# EAGLE schematic tester (EAGLE 6.4)
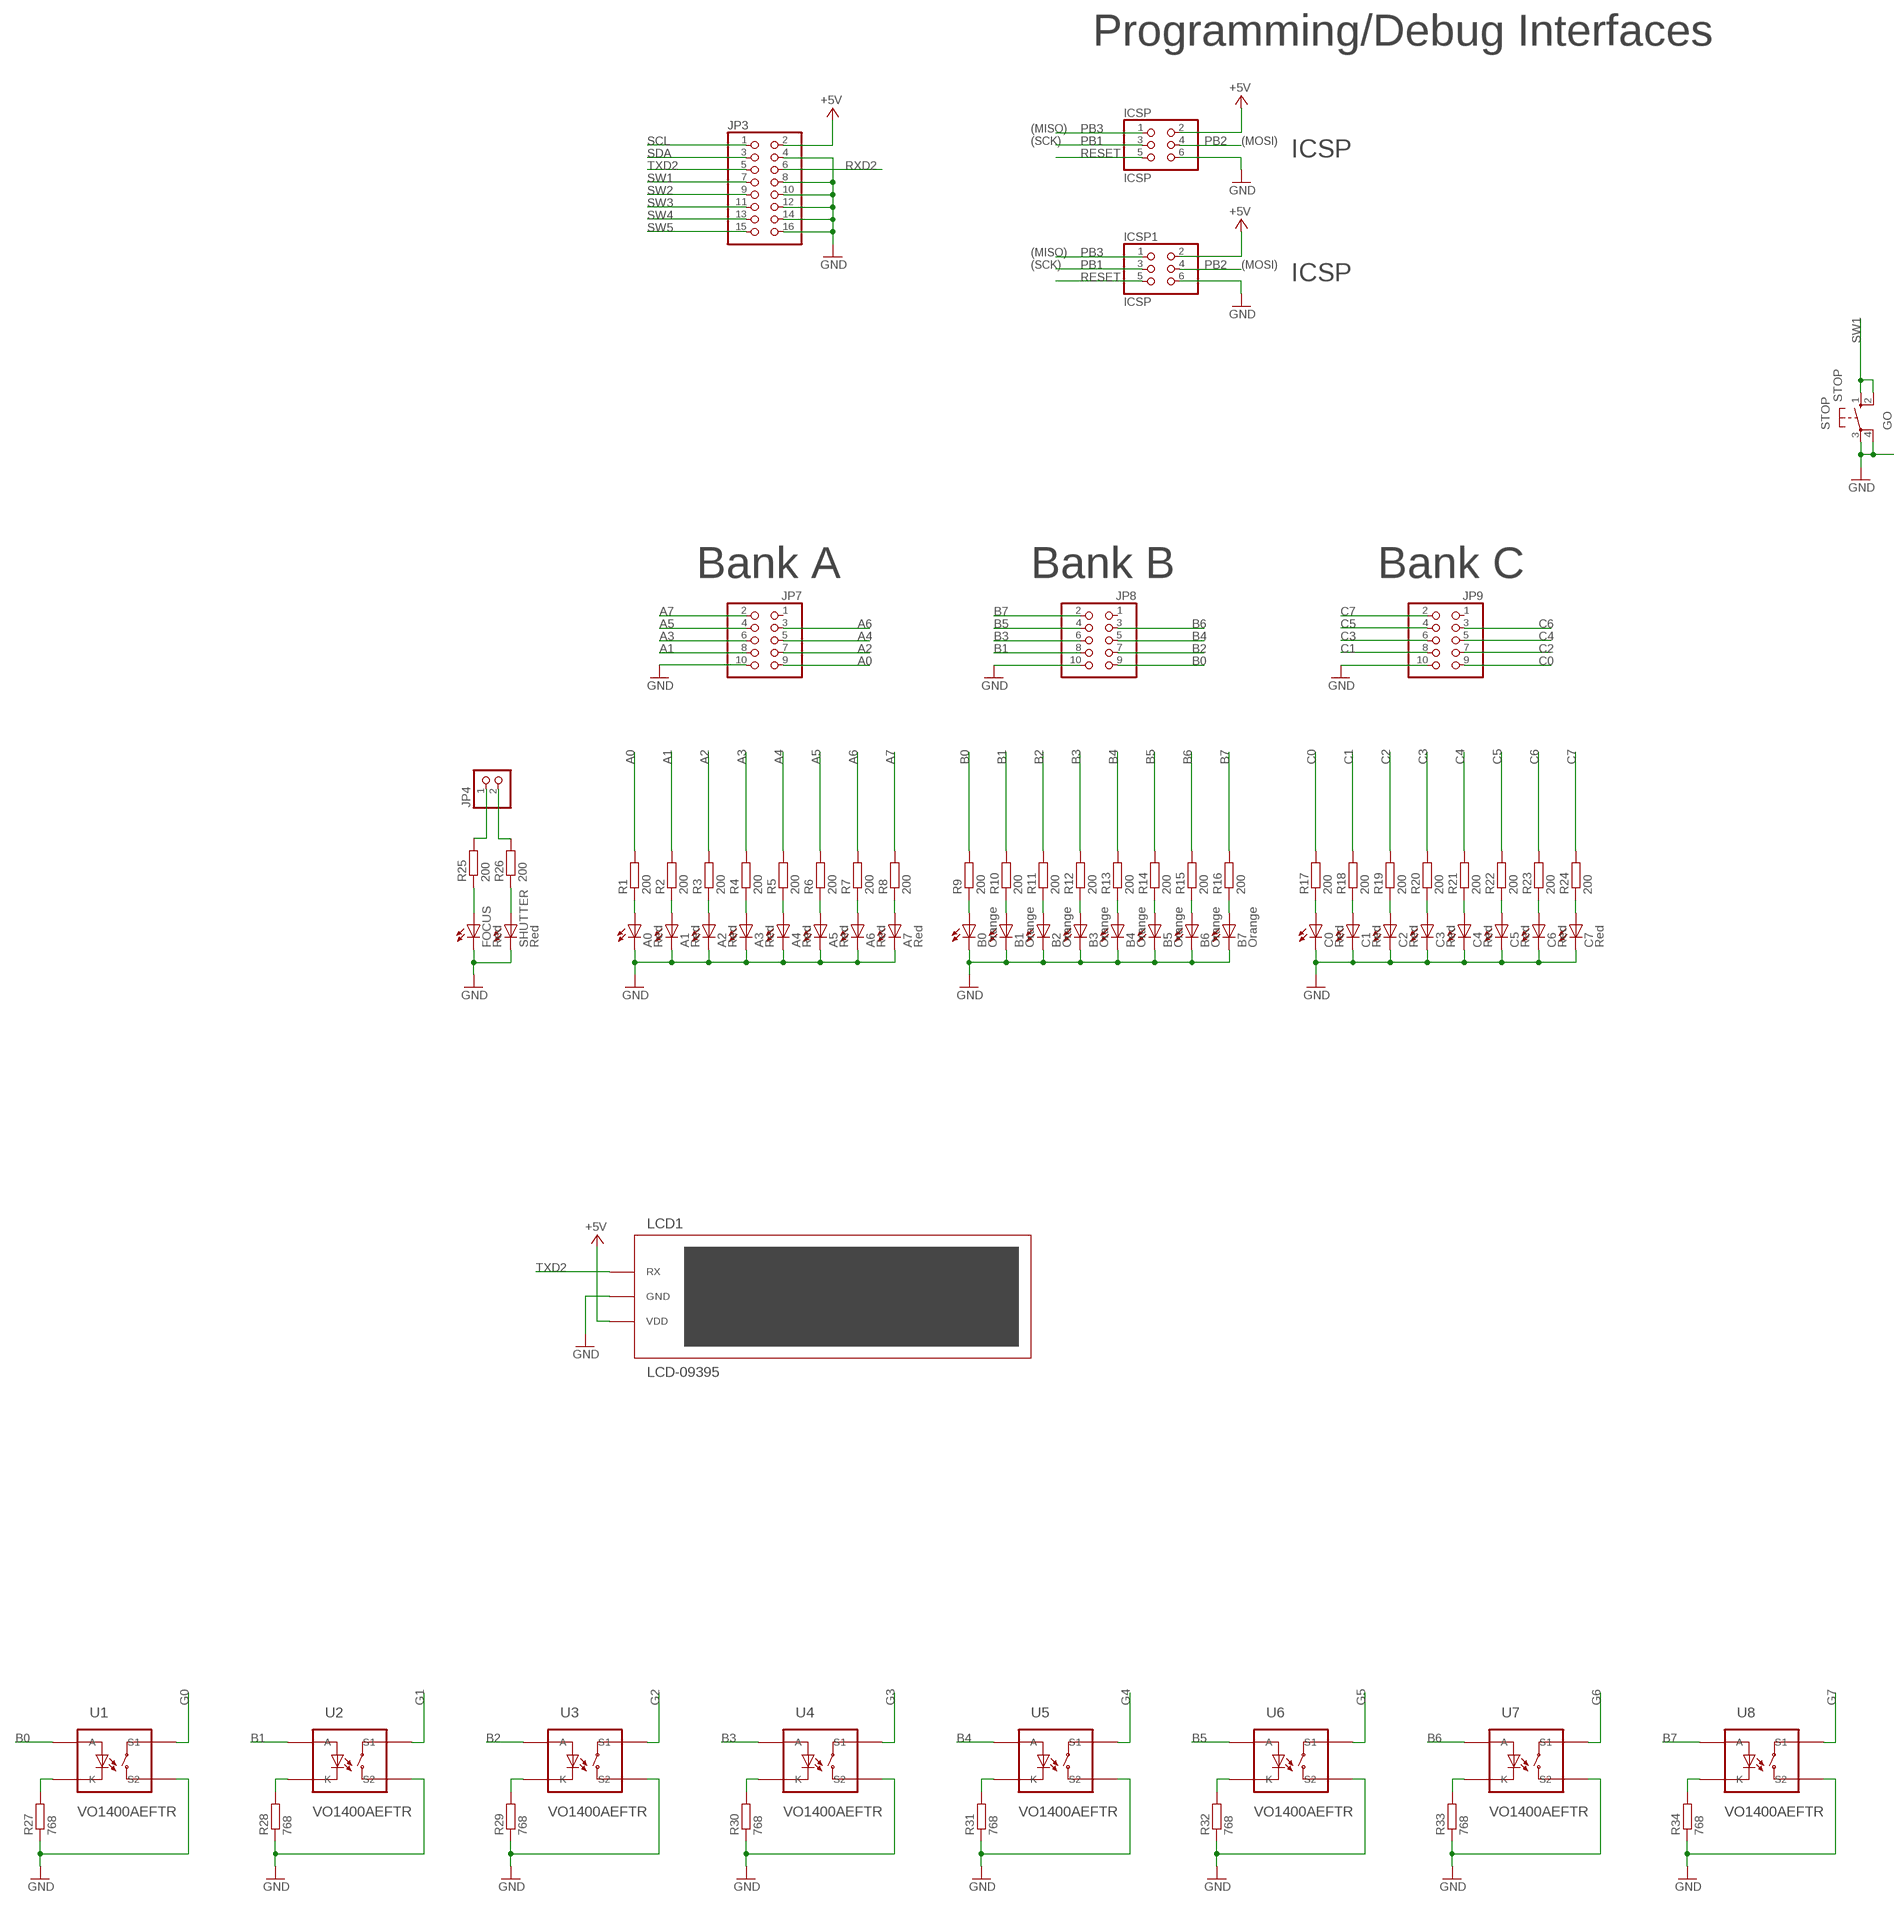
[diagram p0: schematic, sheet 1, part 1 of 2]
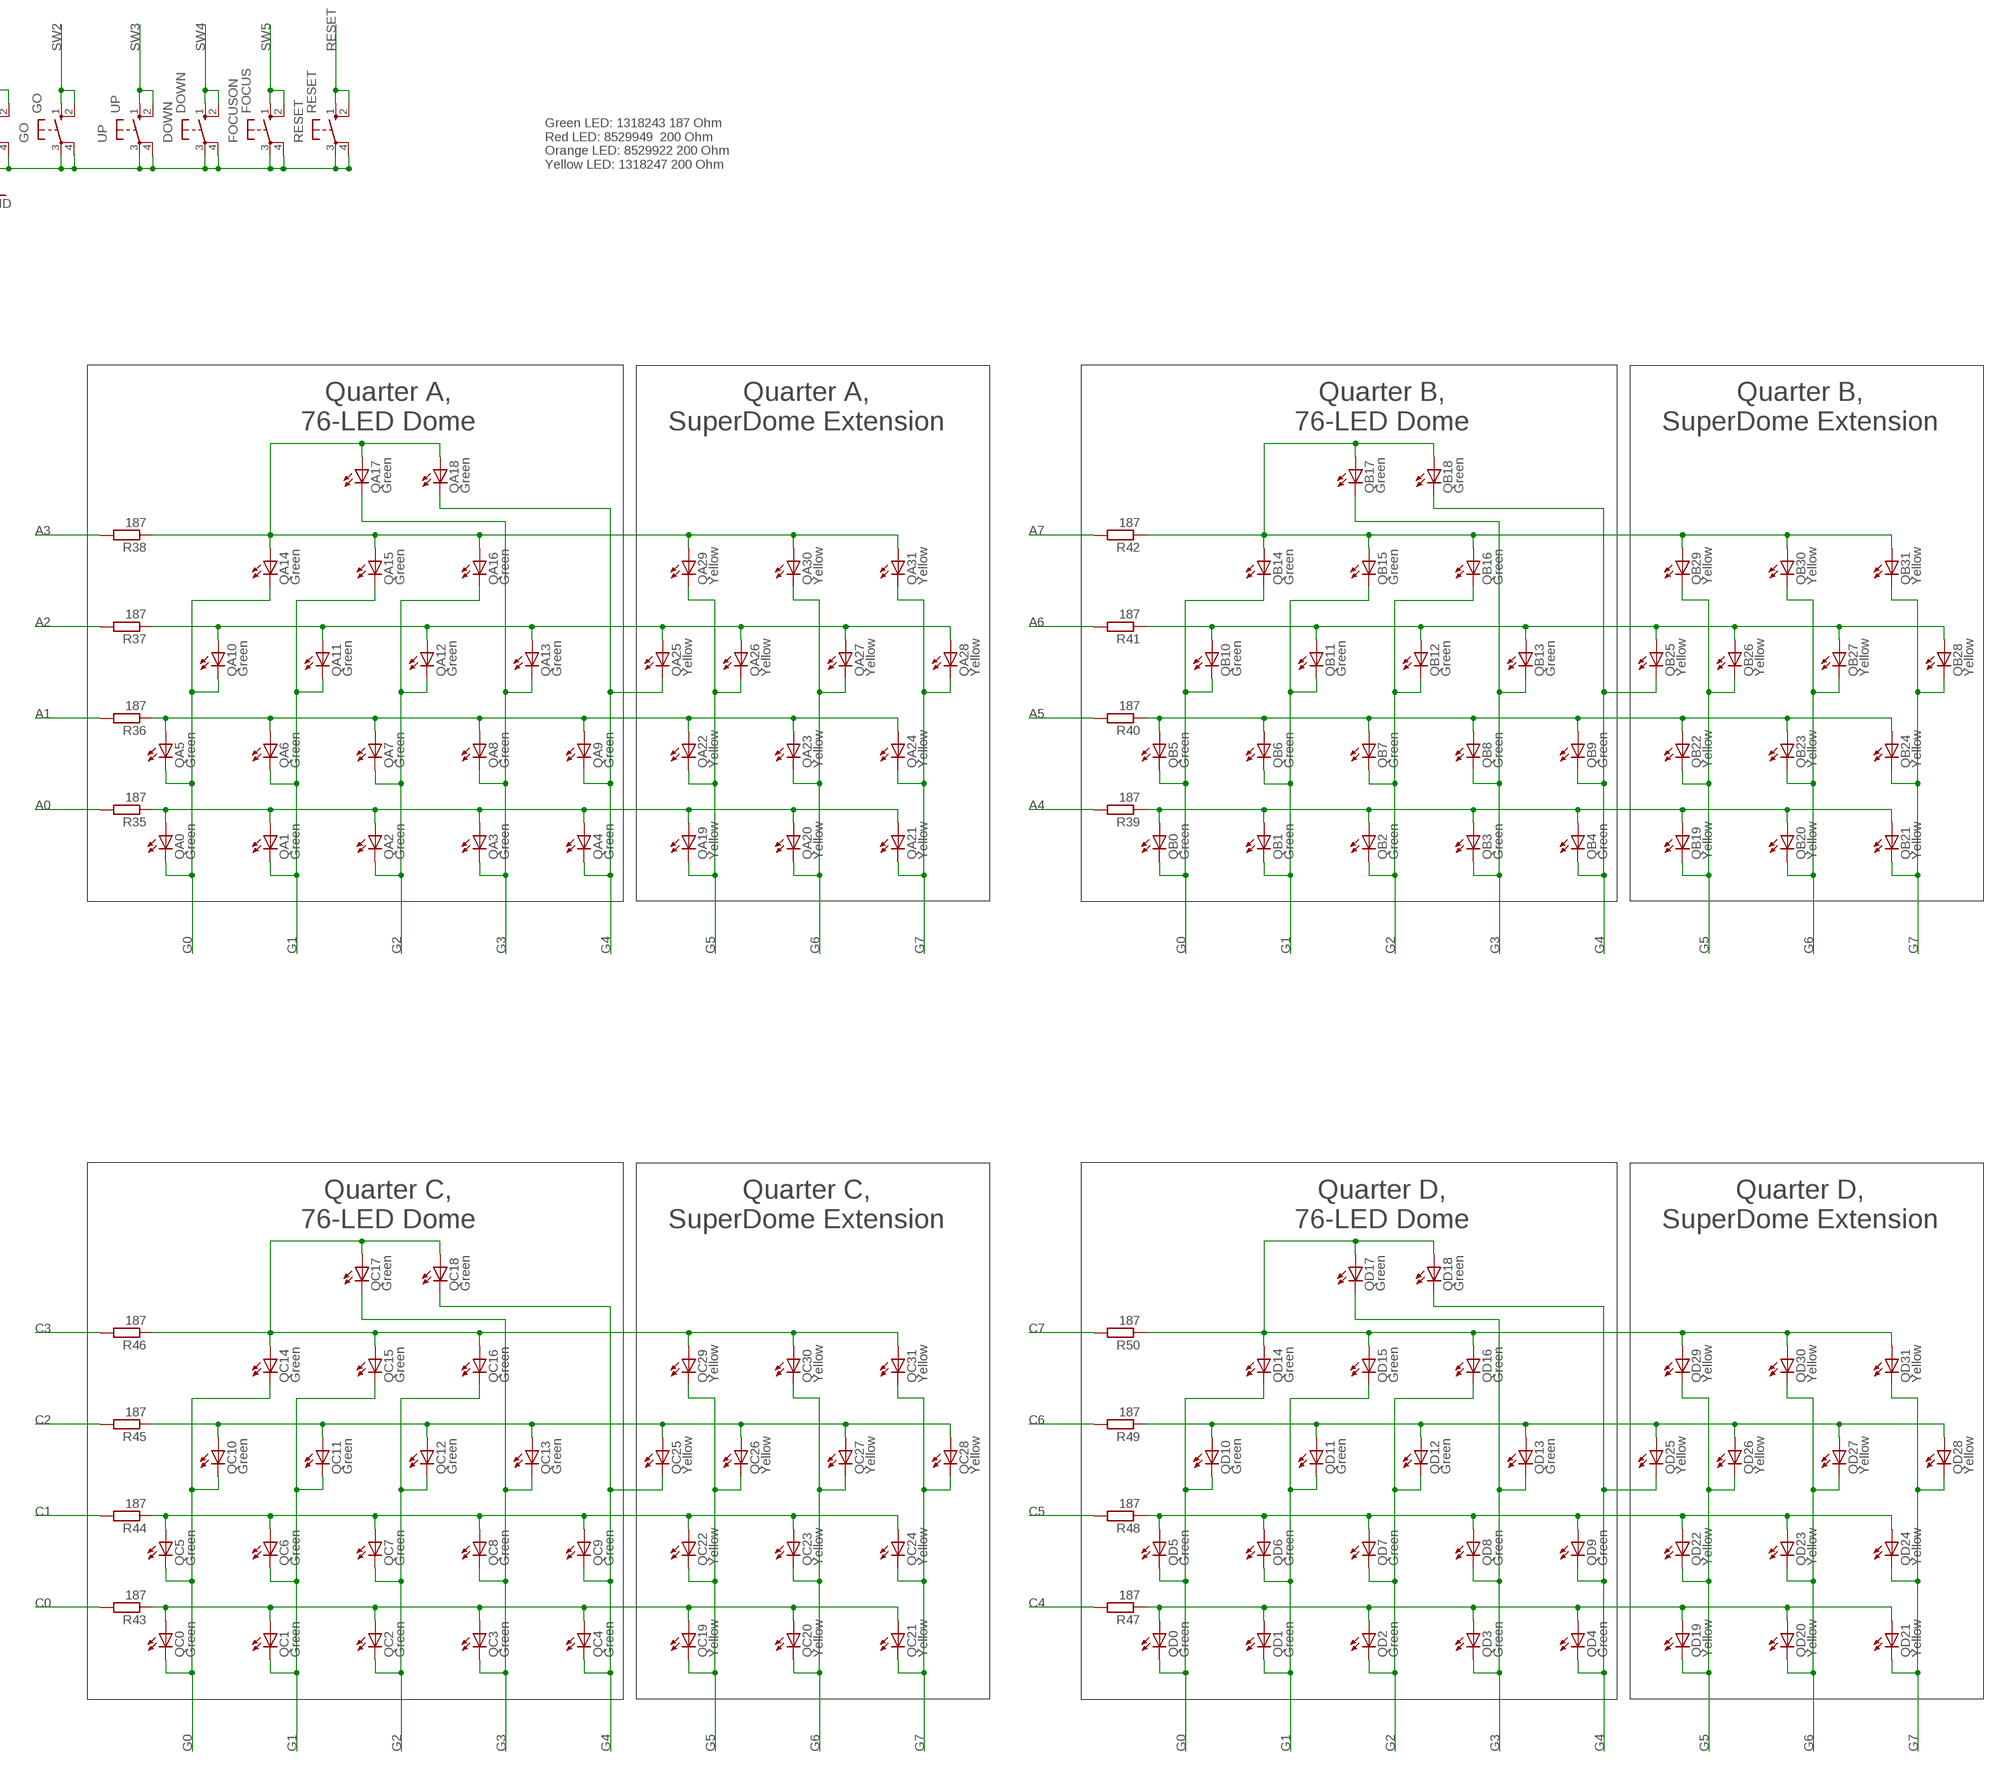
[diagram p1: schematic, sheet 1, part 2 of 2]

## Parts
A0  Red  LEDCHIP-LED0805  [CHIP-LED0805]
A1  Red  LEDCHIP-LED0805  [CHIP-LED0805]
A2  Red  LEDCHIP-LED0805  [CHIP-LED0805]
A3  Red  LEDCHIP-LED0805  [CHIP-LED0805]
A4  Red  LEDCHIP-LED0805  [CHIP-LED0805]
A5  Red  LEDCHIP-LED0805  [CHIP-LED0805]
A6  Red  LEDCHIP-LED0805  [CHIP-LED0805]
A7  Red  LEDCHIP-LED0805  [CHIP-LED0805]
B0  Orange  LEDCHIP-LED0805  [CHIP-LED0805]
B1  Orange  LEDCHIP-LED0805  [CHIP-LED0805]
B2  Orange  LEDCHIP-LED0805  [CHIP-LED0805]
B3  Orange  LEDCHIP-LED0805  [CHIP-LED0805]
B4  Orange  LEDCHIP-LED0805  [CHIP-LED0805]
B5  Orange  LEDCHIP-LED0805  [CHIP-LED0805]
B6  Orange  LEDCHIP-LED0805  [CHIP-LED0805]
B7  Orange  LEDCHIP-LED0805  [CHIP-LED0805]
C0  Red  LEDCHIP-LED0805  [CHIP-LED0805]
C1  Red  LEDCHIP-LED0805  [CHIP-LED0805]
C2  Red  LEDCHIP-LED0805  [CHIP-LED0805]
C3  Red  LEDCHIP-LED0805  [CHIP-LED0805]
C4  Red  LEDCHIP-LED0805  [CHIP-LED0805]
C5  Red  LEDCHIP-LED0805  [CHIP-LED0805]
C6  Red  LEDCHIP-LED0805  [CHIP-LED0805]
C7  Red  LEDCHIP-LED0805  [CHIP-LED0805]
DOWN  DOWN  10-XX  [B3F-10XX]
FOCUS  Red  LEDCHIP-LED0805  [CHIP-LED0805]
FOCUSON  FOCUS  10-XX  [B3F-10XX]
GO  GO  10-XX  [B3F-10XX]
ICSP  ICSP  PINHD-2X3  [2X03]
ICSP1  ICSP  PINHD-2X3  [2X03]
JP3  PINHD-2X8  [2X08]
JP4  PINHD-1X2  [1X02]
JP7  PINHD-2X5  [2X05]
JP8  PINHD-2X5  [2X05]
JP9  PINHD-2X5  [2X05]
LCD1  LCD-09395  [LCD-09395]
QA0  Green  LEDCHIP-LED0805  [CHIP-LED0805]
QA1  Green  LEDCHIP-LED0805  [CHIP-LED0805]
QA2  Green  LEDCHIP-LED0805  [CHIP-LED0805]
QA3  Green  LEDCHIP-LED0805  [CHIP-LED0805]
QA4  Green  LEDCHIP-LED0805  [CHIP-LED0805]
QA5  Green  LEDCHIP-LED0805  [CHIP-LED0805]
QA6  Green  LEDCHIP-LED0805  [CHIP-LED0805]
QA7  Green  LEDCHIP-LED0805  [CHIP-LED0805]
QA8  Green  LEDCHIP-LED0805  [CHIP-LED0805]
QA9  Green  LEDCHIP-LED0805  [CHIP-LED0805]
QA10  Green  LEDCHIP-LED0805  [CHIP-LED0805]
QA11  Green  LEDCHIP-LED0805  [CHIP-LED0805]
QA12  Green  LEDCHIP-LED0805  [CHIP-LED0805]
QA13  Green  LEDCHIP-LED0805  [CHIP-LED0805]
QA14  Green  LEDCHIP-LED0805  [CHIP-LED0805]
QA15  Green  LEDCHIP-LED0805  [CHIP-LED0805]
QA16  Green  LEDCHIP-LED0805  [CHIP-LED0805]
QA17  Green  LEDCHIP-LED0805  [CHIP-LED0805]
QA18  Green  LEDCHIP-LED0805  [CHIP-LED0805]
QA19  Yellow  LEDCHIP-LED0805  [CHIP-LED0805]
QA20  Yellow  LEDCHIP-LED0805  [CHIP-LED0805]
QA21  Yellow  LEDCHIP-LED0805  [CHIP-LED0805]
QA22  Yellow  LEDCHIP-LED0805  [CHIP-LED0805]
QA23  Yellow  LEDCHIP-LED0805  [CHIP-LED0805]
QA24  Yellow  LEDCHIP-LED0805  [CHIP-LED0805]
QA25  Yellow  LEDCHIP-LED0805  [CHIP-LED0805]
QA26  Yellow  LEDCHIP-LED0805  [CHIP-LED0805]
QA27  Yellow  LEDCHIP-LED0805  [CHIP-LED0805]
QA28  Yellow  LEDCHIP-LED0805  [CHIP-LED0805]
QA29  Yellow  LEDCHIP-LED0805  [CHIP-LED0805]
QA30  Yellow  LEDCHIP-LED0805  [CHIP-LED0805]
QA31  Yellow  LEDCHIP-LED0805  [CHIP-LED0805]
QB0  Green  LEDCHIP-LED0805  [CHIP-LED0805]
QB1  Green  LEDCHIP-LED0805  [CHIP-LED0805]
QB2  Green  LEDCHIP-LED0805  [CHIP-LED0805]
QB3  Green  LEDCHIP-LED0805  [CHIP-LED0805]
QB4  Green  LEDCHIP-LED0805  [CHIP-LED0805]
QB5  Green  LEDCHIP-LED0805  [CHIP-LED0805]
QB6  Green  LEDCHIP-LED0805  [CHIP-LED0805]
QB7  Green  LEDCHIP-LED0805  [CHIP-LED0805]
QB8  Green  LEDCHIP-LED0805  [CHIP-LED0805]
QB9  Green  LEDCHIP-LED0805  [CHIP-LED0805]
QB10  Green  LEDCHIP-LED0805  [CHIP-LED0805]
QB11  Green  LEDCHIP-LED0805  [CHIP-LED0805]
QB12  Green  LEDCHIP-LED0805  [CHIP-LED0805]
QB13  Green  LEDCHIP-LED0805  [CHIP-LED0805]
QB14  Green  LEDCHIP-LED0805  [CHIP-LED0805]
QB15  Green  LEDCHIP-LED0805  [CHIP-LED0805]
QB16  Green  LEDCHIP-LED0805  [CHIP-LED0805]
QB17  Green  LEDCHIP-LED0805  [CHIP-LED0805]
QB18  Green  LEDCHIP-LED0805  [CHIP-LED0805]
QB19  Yellow  LEDCHIP-LED0805  [CHIP-LED0805]
QB20  Yellow  LEDCHIP-LED0805  [CHIP-LED0805]
QB21  Yellow  LEDCHIP-LED0805  [CHIP-LED0805]
QB22  Yellow  LEDCHIP-LED0805  [CHIP-LED0805]
QB23  Yellow  LEDCHIP-LED0805  [CHIP-LED0805]
QB24  Yellow  LEDCHIP-LED0805  [CHIP-LED0805]
QB25  Yellow  LEDCHIP-LED0805  [CHIP-LED0805]
QB26  Yellow  LEDCHIP-LED0805  [CHIP-LED0805]
QB27  Yellow  LEDCHIP-LED0805  [CHIP-LED0805]
QB28  Yellow  LEDCHIP-LED0805  [CHIP-LED0805]
QB29  Yellow  LEDCHIP-LED0805  [CHIP-LED0805]
QB30  Yellow  LEDCHIP-LED0805  [CHIP-LED0805]
QB31  Yellow  LEDCHIP-LED0805  [CHIP-LED0805]
QC0  Green  LEDCHIP-LED0805  [CHIP-LED0805]
QC1  Green  LEDCHIP-LED0805  [CHIP-LED0805]
QC2  Green  LEDCHIP-LED0805  [CHIP-LED0805]
QC3  Green  LEDCHIP-LED0805  [CHIP-LED0805]
QC4  Green  LEDCHIP-LED0805  [CHIP-LED0805]
QC5  Green  LEDCHIP-LED0805  [CHIP-LED0805]
QC6  Green  LEDCHIP-LED0805  [CHIP-LED0805]
QC7  Green  LEDCHIP-LED0805  [CHIP-LED0805]
QC8  Green  LEDCHIP-LED0805  [CHIP-LED0805]
QC9  Green  LEDCHIP-LED0805  [CHIP-LED0805]
QC10  Green  LEDCHIP-LED0805  [CHIP-LED0805]
QC11  Green  LEDCHIP-LED0805  [CHIP-LED0805]
QC12  Green  LEDCHIP-LED0805  [CHIP-LED0805]
QC13  Green  LEDCHIP-LED0805  [CHIP-LED0805]
QC14  Green  LEDCHIP-LED0805  [CHIP-LED0805]
QC15  Green  LEDCHIP-LED0805  [CHIP-LED0805]
QC16  Green  LEDCHIP-LED0805  [CHIP-LED0805]
QC17  Green  LEDCHIP-LED0805  [CHIP-LED0805]
QC18  Green  LEDCHIP-LED0805  [CHIP-LED0805]
QC19  Yellow  LEDCHIP-LED0805  [CHIP-LED0805]
QC20  Yellow  LEDCHIP-LED0805  [CHIP-LED0805]
QC21  Yellow  LEDCHIP-LED0805  [CHIP-LED0805]
QC22  Yellow  LEDCHIP-LED0805  [CHIP-LED0805]
QC23  Yellow  LEDCHIP-LED0805  [CHIP-LED0805]
QC24  Yellow  LEDCHIP-LED0805  [CHIP-LED0805]
QC25  Yellow  LEDCHIP-LED0805  [CHIP-LED0805]
QC26  Yellow  LEDCHIP-LED0805  [CHIP-LED0805]
QC27  Yellow  LEDCHIP-LED0805  [CHIP-LED0805]
QC28  Yellow  LEDCHIP-LED0805  [CHIP-LED0805]
QC29  Yellow  LEDCHIP-LED0805  [CHIP-LED0805]
QC30  Yellow  LEDCHIP-LED0805  [CHIP-LED0805]
QC31  Yellow  LEDCHIP-LED0805  [CHIP-LED0805]
QD0  Green  LEDCHIP-LED0805  [CHIP-LED0805]
QD1  Green  LEDCHIP-LED0805  [CHIP-LED0805]
QD2  Green  LEDCHIP-LED0805  [CHIP-LED0805]
QD3  Green  LEDCHIP-LED0805  [CHIP-LED0805]
QD4  Green  LEDCHIP-LED0805  [CHIP-LED0805]
QD5  Green  LEDCHIP-LED0805  [CHIP-LED0805]
QD6  Green  LEDCHIP-LED0805  [CHIP-LED0805]
QD7  Green  LEDCHIP-LED0805  [CHIP-LED0805]
QD8  Green  LEDCHIP-LED0805  [CHIP-LED0805]
QD9  Green  LEDCHIP-LED0805  [CHIP-LED0805]
QD10  Green  LEDCHIP-LED0805  [CHIP-LED0805]
QD11  Green  LEDCHIP-LED0805  [CHIP-LED0805]
QD12  Green  LEDCHIP-LED0805  [CHIP-LED0805]
QD13  Green  LEDCHIP-LED0805  [CHIP-LED0805]
QD14  Green  LEDCHIP-LED0805  [CHIP-LED0805]
QD15  Green  LEDCHIP-LED0805  [CHIP-LED0805]
QD16  Green  LEDCHIP-LED0805  [CHIP-LED0805]
QD17  Green  LEDCHIP-LED0805  [CHIP-LED0805]
QD18  Green  LEDCHIP-LED0805  [CHIP-LED0805]
QD19  Yellow  LEDCHIP-LED0805  [CHIP-LED0805]
QD20  Yellow  LEDCHIP-LED0805  [CHIP-LED0805]
QD21  Yellow  LEDCHIP-LED0805  [CHIP-LED0805]
QD22  Yellow  LEDCHIP-LED0805  [CHIP-LED0805]
QD23  Yellow  LEDCHIP-LED0805  [CHIP-LED0805]
QD24  Yellow  LEDCHIP-LED0805  [CHIP-LED0805]
QD25  Yellow  LEDCHIP-LED0805  [CHIP-LED0805]
QD26  Yellow  LEDCHIP-LED0805  [CHIP-LED0805]
QD27  Yellow  LEDCHIP-LED0805  [CHIP-LED0805]
QD28  Yellow  LEDCHIP-LED0805  [CHIP-LED0805]
QD29  Yellow  LEDCHIP-LED0805  [CHIP-LED0805]
QD30  Yellow  LEDCHIP-LED0805  [CHIP-LED0805]
QD31  Yellow  LEDCHIP-LED0805  [CHIP-LED0805]
R1  200  R-EU_R0805  [R0805]
R2  200  R-EU_R0805  [R0805]
R3  200  R-EU_R0805  [R0805]
R4  200  R-EU_R0805  [R0805]
R5  200  R-EU_R0805  [R0805]
R6  200  R-EU_R0805  [R0805]
R7  200  R-EU_R0805  [R0805]
R8  200  R-EU_R0805  [R0805]
R9  200  R-EU_R0805  [R0805]
R10  200  R-EU_R0805  [R0805]
R11  200  R-EU_R0805  [R0805]
R12  200  R-EU_R0805  [R0805]
R13  200  R-EU_R0805  [R0805]
R14  200  R-EU_R0805  [R0805]
R15  200  R-EU_R0805  [R0805]
R16  200  R-EU_R0805  [R0805]
R17  200  R-EU_R0805  [R0805]
R18  200  R-EU_R0805  [R0805]
R19  200  R-EU_R0805  [R0805]
R20  200  R-EU_R0805  [R0805]
R21  200  R-EU_R0805  [R0805]
R22  200  R-EU_R0805  [R0805]
R23  200  R-EU_R0805  [R0805]
R24  200  R-EU_R0805  [R0805]
R25  200  R-EU_R0805  [R0805]
R26  200  R-EU_R0805  [R0805]
R27  768  R-EU_R0805  [R0805]
R28  768  R-EU_R0805  [R0805]
R29  768  R-EU_R0805  [R0805]
R30  768  R-EU_R0805  [R0805]
R31  768  R-EU_R0805  [R0805]
R32  768  R-EU_R0805  [R0805]
R33  768  R-EU_R0805  [R0805]
R34  768  R-EU_R0805  [R0805]
R35  187  R-EU_R0805  [R0805]
R36  187  R-EU_R0805  [R0805]
R37  187  R-EU_R0805  [R0805]
R38  187  R-EU_R0805  [R0805]
R39  187  R-EU_R0805  [R0805]
R40  187  R-EU_R0805  [R0805]
R41  187  R-EU_R0805  [R0805]
R42  187  R-EU_R0805  [R0805]
R43  187  R-EU_R0805  [R0805]
R44  187  R-EU_R0805  [R0805]
R45  187  R-EU_R0805  [R0805]
R46  187  R-EU_R0805  [R0805]
R47  187  R-EU_R0805  [R0805]
R48  187  R-EU_R0805  [R0805]
R49  187  R-EU_R0805  [R0805]
R50  187  R-EU_R0805  [R0805]
RESET  RESET  10-XX  [B3F-10XX]
SHUTTER  Red  LEDCHIP-LED0805  [CHIP-LED0805]
STOP  STOP  10-XX  [B3F-10XX]
U1  VO1400AEFTR  [SOP4]
U2  VO1400AEFTR  [SOP4]
U3  VO1400AEFTR  [SOP4]
U4  VO1400AEFTR  [SOP4]
U5  VO1400AEFTR  [SOP4]
U6  VO1400AEFTR  [SOP4]
U7  VO1400AEFTR  [SOP4]
U8  VO1400AEFTR  [SOP4]
UP  UP  10-XX  [B3F-10XX]

## Nets
+5V [usbvcc]: ICSP1.2 ICSP.2 JP3.2 LCD1.P$3(VDD)
A0: JP7.9 R1.2 R35.2
A1: JP7.8 R2.2 R36.2
A2: JP7.7 R3.2 R37.2
A3: JP7.6 R4.2 R38.2
A4: JP7.5 R5.2 R39.2
A5: JP7.4 R6.2 R40.2
A6: JP7.3 R7.2 R41.2
A7: JP7.2 R8.2 R42.2
B0: JP8.9 R9.2 U1.P$1(A)
B1: JP8.8 R10.2 U2.P$1(A)
B2: JP8.7 R11.2 U3.P$1(A)
B3: JP8.6 R12.2 U4.P$1(A)
B4: JP8.5 R13.2 U5.P$1(A)
B5: JP8.4 R14.2 U6.P$1(A)
B6: JP8.3 R15.2 U7.P$1(A)
B7: JP8.2 R16.2 U8.P$1(A)
C0: JP9.9 R17.2 R43.2
C1: JP9.8 R18.2 R44.2
C2: JP9.7 R19.2 R45.2
C3: JP9.6 R20.2 R46.2
C4: JP9.5 R21.2 R47.2
C5: JP9.4 R22.2 R48.2
C6: JP9.3 R23.2 R49.2
C7: JP9.2 R24.2 R50.2
FOCUS: JP4.1 R25.2
G0: QA0.C QA5.C QA10.C QA14.C QB0.C QB5.C QB10.C QB14.C QC0.C QC5.C QC10.C QC14.C QD0.C QD5.C QD10.C QD14.C U1.P$4(S1)
G1: QA1.C QA6.C QA11.C QA15.C QB1.C QB6.C QB11.C QB15.C QC1.C QC6.C QC11.C QC15.C QD1.C QD6.C QD11.C QD15.C U2.P$4(S1)
G2: QA2.C QA7.C QA12.C QA16.C QB2.C QB7.C QB12.C QB16.C QC2.C QC7.C QC12.C QC16.C QD2.C QD7.C QD12.C QD16.C U3.P$4(S1)
G3: QA3.C QA8.C QA13.C QA17.C QB3.C QB8.C QB13.C QB17.C QC3.C QC8.C QC13.C QC17.C QD3.C QD8.C QD13.C QD17.C U4.P$4(S1)
G4: QA4.C QA9.C QA18.C QA25.C QB4.C QB9.C QB18.C QB25.C QC4.C QC9.C QC18.C QC25.C QD4.C QD9.C QD18.C QD25.C U5.P$4(S1)
G5: QA19.C QA22.C QA26.C QA29.C QB19.C QB22.C QB26.C QB29.C QC19.C QC22.C QC26.C QC29.C QD19.C QD22.C QD26.C QD29.C U6.P$4(S1)
G6: QA20.C QA23.C QA27.C QA30.C QB20.C QB23.C QB27.C QB30.C QC20.C QC23.C QC27.C QC30.C QD20.C QD23.C QD27.C QD30.C U7.P$4(S1)
G7: QA21.C QA24.C QA28.C QA31.C QB21.C QB24.C QB28.C QB31.C QC21.C QC24.C QC28.C QC31.C QD21.C QD24.C QD28.C QD31.C U8.P$4(S1)
GND [gnd]: A0.C A1.C A2.C A3.C A4.C A5.C A6.C A7.C B0.C B1.C B2.C B3.C B4.C B5.C B6.C B7.C C0.C C1.C C2.C C3.C C4.C C5.C C6.C C7.C DOWN.3(P) DOWN.4(P1) FOCUS.C FOCUSON.3(P) FOCUSON.4(P1) GO.3(P) GO.4(P1) ICSP1.6 ICSP.6 JP3.4 JP3.8 JP3.10 JP3.12 JP3.14 JP3.16 JP7.10 JP8.10 JP9.10 LCD1.P$2(GND) R27.1 R28.1 R29.1 R30.1 R31.1 R32.1 R33.1 R34.1 RESET.3(P) RESET.4(P1) SHUTTER.C STOP.3(P) STOP.4(P1) U1.P$3(S2) U2.P$3(S2) U3.P$3(S2) U4.P$3(S2) U5.P$3(S2) U6.P$3(S2) U7.P$3(S2) U8.P$3(S2) UP.3(P) UP.4(P1)
N$1: A0.A R1.1
N$2: A1.A R2.1
N$3: A2.A R3.1
N$4: A3.A R4.1
N$5: A4.A R5.1
N$8: A5.A R6.1
N$9: A6.A R7.1
N$10: A7.A R8.1
N$11: FOCUS.A R25.1
N$12: B0.A R9.1
N$13: B1.A R10.1
N$14: B2.A R11.1
N$15: B3.A R12.1
N$16: B4.A R13.1
N$17: B5.A R14.1
N$18: B6.A R15.1
N$19: B7.A R16.1
N$20: C0.A R17.1
N$21: C1.A R18.1
N$22: C2.A R19.1
N$23: C3.A R20.1
N$24: C4.A R21.1
N$25: C5.A R22.1
N$26: C6.A R23.1
N$27: C7.A R24.1
N$28: R26.1 SHUTTER.A
N$31: R27.2 U1.P$2(K)
N$38: R28.2 U2.P$2(K)
N$42: QA0.A QA1.A QA2.A QA3.A QA4.A QA19.A QA20.A QA21.A R35.1
N$43: QA5.A QA6.A QA7.A QA8.A QA9.A QA22.A QA23.A QA24.A R36.1
N$44: QA10.A QA11.A QA12.A QA13.A QA25.A QA26.A QA27.A QA28.A R37.1
N$45: QA14.A QA15.A QA16.A QA17.A QA18.A QA29.A QA30.A QA31.A R38.1
N$46: R29.2 U3.P$2(K)
N$55: QB0.A QB1.A QB2.A QB3.A QB4.A QB19.A QB20.A QB21.A R39.1
N$56: QB5.A QB6.A QB7.A QB8.A QB9.A QB22.A QB23.A QB24.A R40.1
N$57: QB10.A QB11.A QB12.A QB13.A QB25.A QB26.A QB27.A QB28.A R41.1
N$58: QB14.A QB15.A QB16.A QB17.A QB18.A QB29.A QB30.A QB31.A R42.1
N$67: QC0.A QC1.A QC2.A QC3.A QC4.A QC19.A QC20.A QC21.A R43.1
N$68: QC5.A QC6.A QC7.A QC8.A QC9.A QC22.A QC23.A QC24.A R44.1
N$69: QC10.A QC11.A QC12.A QC13.A QC25.A QC26.A QC27.A QC28.A R45.1
N$70: QC14.A QC15.A QC16.A QC17.A QC18.A QC29.A QC30.A QC31.A R46.1
N$79: QD0.A QD1.A QD2.A QD3.A QD4.A QD19.A QD20.A QD21.A R47.1
N$80: QD5.A QD6.A QD7.A QD8.A QD9.A QD22.A QD23.A QD24.A R48.1
N$81: QD10.A QD11.A QD12.A QD13.A QD25.A QD26.A QD27.A QD28.A R49.1
N$82: QD14.A QD15.A QD16.A QD17.A QD18.A QD29.A QD30.A QD31.A R50.1
N$83: R30.2 U4.P$2(K)
N$84: R31.2 U5.P$2(K)
N$85: R32.2 U6.P$2(K)
N$86: R33.2 U7.P$2(K)
N$87: R34.2 U8.P$2(K)
PB1: ICSP1.3 ICSP.3
PB2: ICSP1.4 ICSP.4
PB3: ICSP1.1 ICSP.1
RESET: ICSP1.5 ICSP.5 RESET.1(S) RESET.2(S1)
RXD2: JP3.6
SCL: JP3.1
SDA: JP3.3
SHUTTER: JP4.2 R26.2
SW1: JP3.7 STOP.1(S) STOP.2(S1)
SW2: GO.1(S) GO.2(S1) JP3.9
SW3: JP3.11 UP.1(S) UP.2(S1)
SW4: DOWN.1(S) DOWN.2(S1) JP3.13
SW5: FOCUSON.1(S) FOCUSON.2(S1) JP3.15
TXD2: JP3.5 LCD1.P$1(RX)
Unconnected: JP7.1 JP8.1 JP9.1

## Notes on the sheet
- Programming/Debug Interfaces
- (MISO)
- (SCK) | (MOSI)
- ICSP
- (MISO)
- (SCK) | (MOSI)
- ICSP
- Green LED:	1318243	187 Ohm
  Red LED:	8529949 	200 Ohm
  Orange LED:	8529922	200 Ohm
  Yellow LED:	1318247	200 Ohm
- Bank A | Bank B | Bank C
- Quarter A,
  76-LED Dome
- Quarter A,
  SuperDome Extension
- Quarter B,
  76-LED Dome
- Quarter B,
  SuperDome Extension
- Quarter C,
  76-LED Dome
- Quarter C,
  SuperDome Extension
- Quarter D,
  76-LED Dome
- Quarter D,
  SuperDome Extension

## Library data of the parts
A0 A1-A7 B0 B1-B7 C0 C1-C7 FOCUS QA0 QA1-QA31 QB0 QB1-QB31 QC0 QC1-QC31 QD0 QD1-QD31 SHUTTER = led:LED: LED OSRAM: - CHIPLED LG R971, LG N971, LY N971, LG Q971, LY Q971, LO R971, LY R971 LH N974, LH R974 LS Q976, LO Q976, LY Q976 LO Q996 - Hyper CHIPLED LW Q18S LB Q993, LB Q99A, LB R99A - SideLED LS A670, LO A670, LY A670, LG A670, LP A670 LB A673, LV A673, LT A673, LW A673 LH A674 LY A675 LS A676, LA A676, LO A676, LY A676, LW A676 LS A679, LY A679, LG A679 - Hyper Micro SIDELED® LS Y876, LA Y876, LO Y876, LY Y876 LT Y87S - SmartLED LW L88C, LW L88S LB L89C, LB L89S, LG L890 LS L89K, LO L89K, LY L89K LS L896, LA L896, LO L896, LY L896 - TOPLED LS T670, LO T670, LY T670, LG T670, LP T670 LSG T670, LSP T670, LSY T670, LOP T670, LYG T670 LG T671, LOG T671, LSG T671 LB T673, LV T673, LT T673, LW T673 LH T674 LS T676, LA T676, LO T676, LY T676, LB T676, LH T676, LSB T676, LW T676 LB T67C, LV T67C, LT T67C, LS T67K, LO T67K, LY T67K, LW E67C LS E67B, LA E67B, LO E67B, LY E67B, LB E67C, LV E67C, LT E67C LW T67C LS T679, LY T679, LG T679 LS T770, LO T770, LY T770, LG T770, LP T770 LB T773, LV T773, LT T773, LW T773 LH T774 LS E675, LA E675, LY E675, LS T675 LS T776, LA T776, LO T776, LY T776, LB T776 LHGB T686 LT T68C, LB T68C - Hyper Mini TOPLED® LB M676 - Mini TOPLED Santana® LG M470 LS M47K, LO M47K, LY M47K Source: http://www.osram.convergy.de LUXEON: - LUMILED® LXK2-PW12-R00, LXK2-PW12-S00, LXK2-PW14-U00, LXK2-PW14-V00 LXK2-PM12-R00, LXK2-PM12-S00, LXK2-PM14-U00 LXK2-PE12-Q00, LXK2-PE12-R00, LXK2-PE12-S00, LXK2-PE14-T00, LXK2-PE14-U00 LXK2-PB12-K00, LXK2-PB12-L00, LXK2-PB12-M00, LXK2-PB14-N00, LXK2-PB14-P00, LXK2-PB14-Q00 LXK2-PR12-L00, LXK2-PR12-M00, LXK2-PR14-Q00, LXK2-PR14-R00 LXK2-PD12-Q00, LXK2-PD12-R00, LXK2-PD12-S00 LXK2-PH12-R00, LXK2-PH12-S00 LXK2-PL12-P00, LXK2-PL12-Q00, LXK2-PL12-R00 Source: www.luxeon.com KINGBRIGHT: KA-3528ASYC Source: www.kingbright.com
DOWN FOCUSON GO RESET STOP UP = switch-omron:10-XX: OMRON SWITCH; MPN: B3F-1000; OC_FARNELL: 176432; OC_NEWARK: 36M3542
ICSP ICSP1 = pinhead:PINHD-2X3: PIN HEADER
JP3 = pinhead:PINHD-2X8: PIN HEADER
JP4 = pinhead:PINHD-1X2: PIN HEADER
JP7-JP9 = pinhead:PINHD-2X5: PIN HEADER
LCD1 = rti:LCD-09395
R1-R50 = rcl:R-EU_: RESISTOR, European symbol
U1-U8 = rti:VO1400AEFTR

## Net classes
0 default: width 0.203 mm, drill 0.2 mm, clearance 0.127 mm
1 power: width 0.203 mm, drill 0.2 mm, clearance 0.127 mm
2 gnd: width 0.203 mm, drill 0.2 mm, clearance 0.127 mm
3 usbvcc: width 0.203 mm, drill 0.2 mm, clearance 0.127 mm